# EAGLE design loochi-0.6 (EAGLE 6.2)
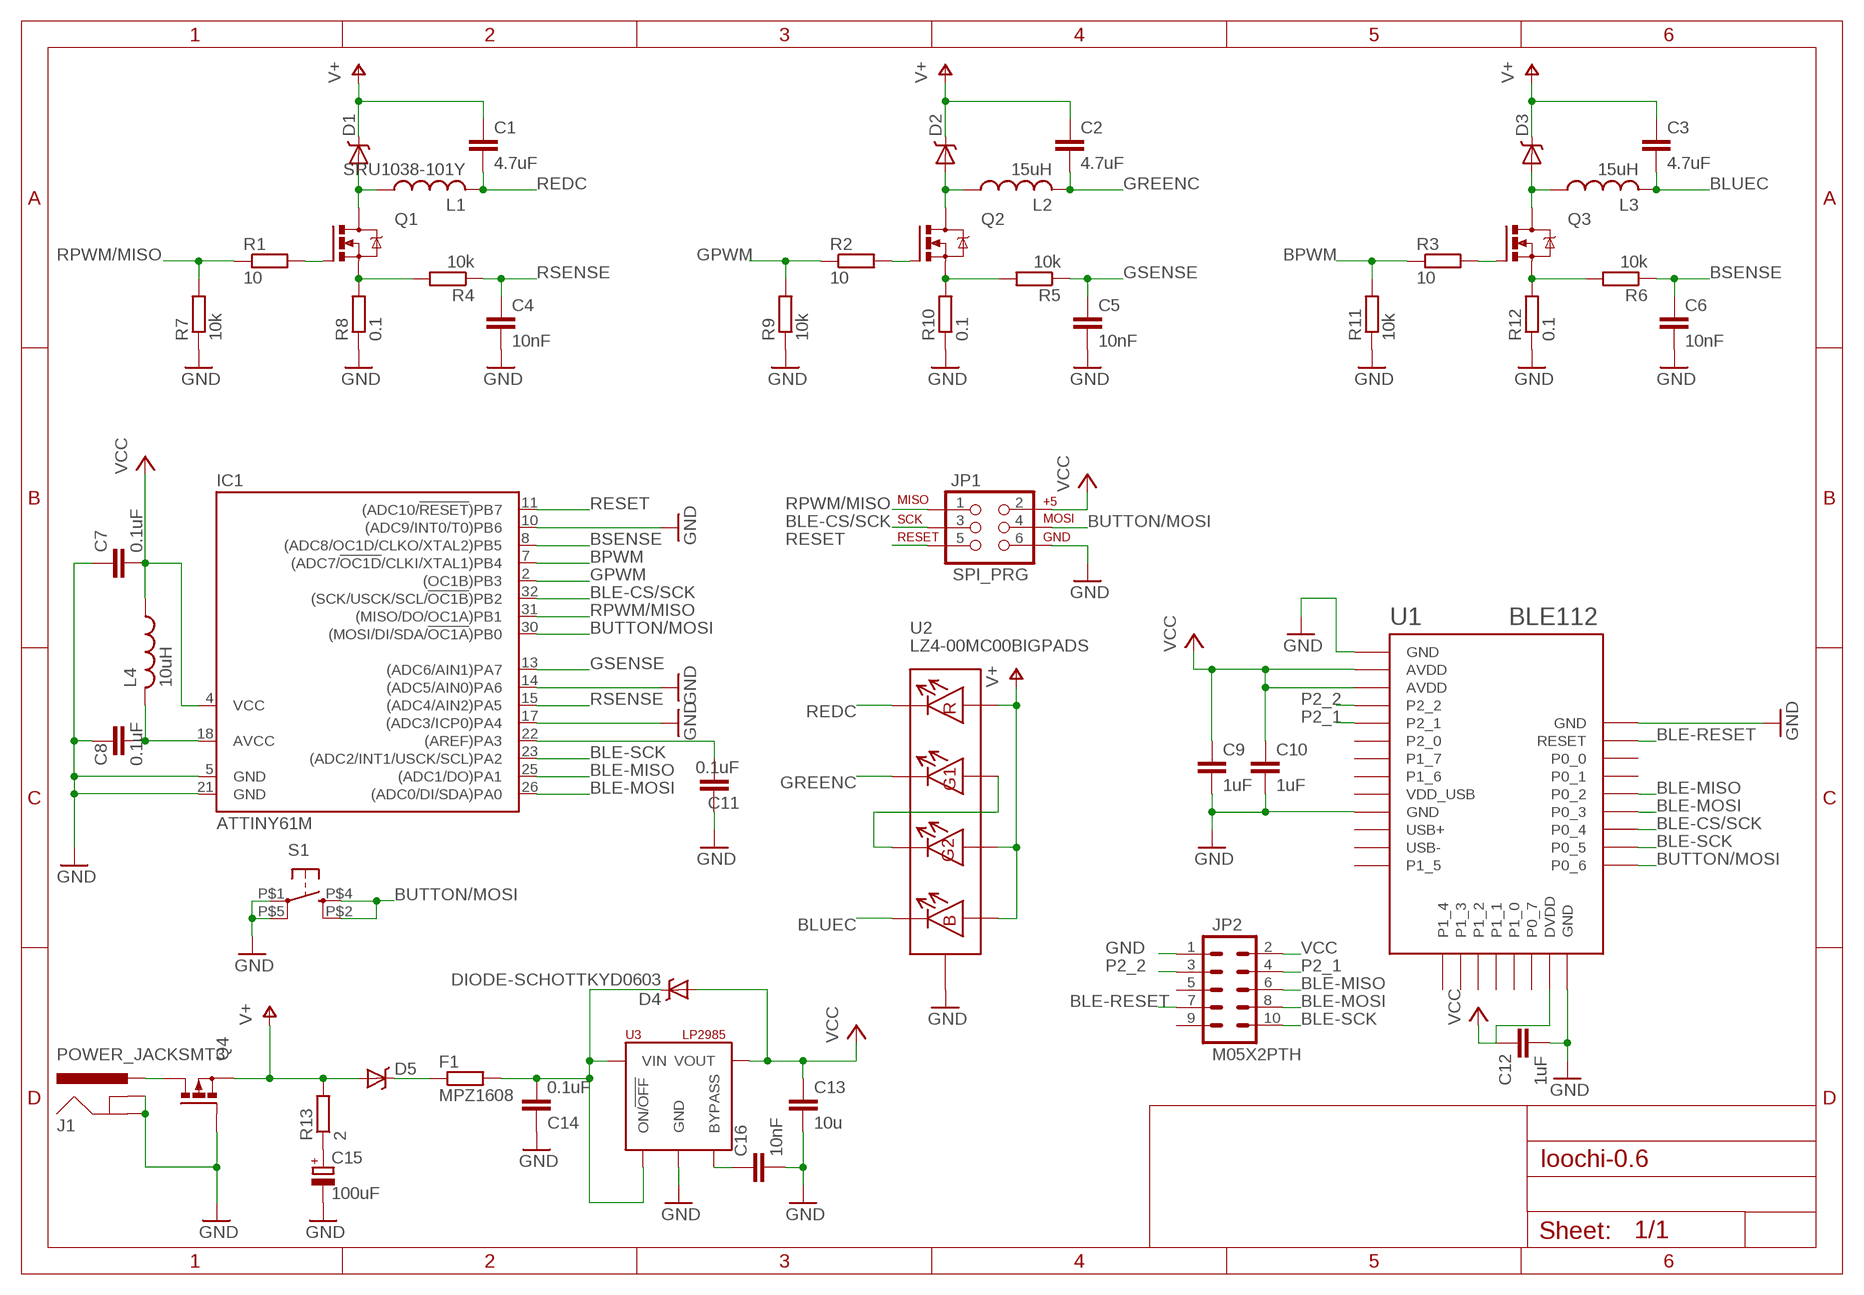
[diagram p0: schematic, sheet 1]

## Parts
C1  4.7uF  C-EUC0603  [C0603]
C2  4.7uF  C-EUC0603  [C0603]
C3  4.7uF  C-EUC0603  [C0603]
C4  10nF  C-EUC0603  [C0603]
C5  10nF  C-EUC0603  [C0603]
C6  10nF  C-EUC0603  [C0603]
C7  0.1uF  C-EUC0603  [C0603]
C8  0.1uF  C-EUC0603  [C0603]
C9  1uF  C-EUC0603  [C0603]
C10  1uF  C-EUC0603  [C0603]
C11  0.1uF  C-EUC0603  [C0603]
C12  1uF  C-EUC0603  [C0603]
C13  10u  C-EUC0603  [C0603]
C14  0.1uF  C-EUC0603K  [C0603K]
C15  100uF  CPOL-EUD  [PANASONIC_D]
C16  10nF  C-EUC0603  [C0603]
D1  PMEG4010CEH  DIODE-SCHOTTKY  [SOD123F]
D2  PMEG4010CEH  DIODE-SCHOTTKY  [SOD123F]
D3  PMEG4010CEH  DIODE-SCHOTTKY  [SOD123F]
D4  DIODE-SCHOTTKYD0603  [D0603]
D5  PMEG4010CEH  DIODE-SCHOTTKY  [SOD123F]
F1  MPZ1608  R-EU_R0603  [R0603]
IC1  ATTINY61M  [MLF32]
J1  POWER_JACKSMT3  [POWER-KYCONSMT3]
JP1  SPI_PRG  AVR_SPI_PRG_6NS  [2X3-NS]
JP2  M05X2PTH  [AVR_ICSP]
L1  SRU1038-101Y  L-USBOURNS-SRU1038  [BOURNS-SRU1038]
L2  15uH  L-USBOURNS-SRU1038  [BOURNS-SRU1038]
L3  15uH  L-USBOURNS-SRU1038  [BOURNS-SRU1038]
L4  10uH  L-USL0603  [L0603]
Q1  PMN25ENSOT457  [SOT457]
Q2  PMN25ENSOT457  [SOT457]
Q3  PMN25ENSOT457  [SOT457]
Q4  FDC654P  [SUPERSOT6]
R1  10  R-EU_R0603  [R0603]
R2  10  R-EU_R0603  [R0603]
R3  10  R-EU_R0603  [R0603]
R4  10k  R-EU_R0603  [R0603]
R5  10k  R-EU_R0603  [R0603]
R6  10k  R-EU_R0603  [R0603]
R7  10k  R-EU_R0603  [R0603]
R8  0.1  R-EU_R0603  [R0603]
R9  10k  R-EU_R0603  [R0603]
R10  0.1  R-EU_R0603  [R0603]
R11  10k  R-EU_R0603  [R0603]
R12  0.1  R-EU_R0603  [R0603]
R13  2  R-EU_R0603  [R0603]
S1  TAC_SWITCH  [CK-KMS_PEGS]
U1  BLE112  SF-BLUEGIGA_BLE112-A-VISUAL  [SF-BLUEGIGA_BLE112-A]
U2  LZ4-00MC00BIGPADS  [LZ4-00MC00-BIGPADS]
U3  LP2985  [DBV]

## Nets
BLE-CS/SCK: IC1.32((SCK/USCK/SCL/!OC1B!)PB2) JP1.3 U1.P0_4
BLE-MISO: IC1.25((ADC1/DO)PA1) JP2.6 U1.P0_2
BLE-MOSI: IC1.26((ADC0/DI/SDA)PA0) JP2.8 U1.P0_3
BLE-RESET: JP2.7 U1.RESET
BLE-SCK: IC1.23((ADC2/INT1/USCK/SCL)PA2) JP2.10 U1.P0_5
BLUEC: C3.2 L3.P$2 U2.P$8
BPWM: IC1.7((ADC7/!OC1D!/CLKI/XTAL1)PB4) R3.1 R11.2
BSENSE: C6.1 IC1.8((ADC8/OC1D/CLKO/XTAL2)PB5) R6.1
BUTTON/MOSI: IC1.30((MOSI/DI/SDA/!OC1A!)PB0) JP1.4 S1.P$2 S1.P$4 U1.P0_6
GND: C4.2 C5.2 C6.2 C7.1 C8.1 C9.2 C10.2 C11.1 C12.2 C13.2 C14.1 C15.- C16.2 IC1.5(GND) IC1.10((ADC9/INT0/T0)PB6) IC1.14((ADC5/AIN0)PA6) IC1.17((ADC3/ICP0)PA4) IC1.21(GND) J1.P$2(GND) J1.P$3(GNDBREAK) JP1.6 JP2.1 Q4.P$3(G) R7.1 R8.1 R9.1 R10.1 R11.1 R12.1 S1.P$1 S1.P$5 U1.GND1(GND) U1.GND2(GND) U1.GND3(GND) U1.GND4(GND) U2.P$9(THERMAL) U2.THERMAL U2.THERMAL1(THERMAL) U2.THERMAL2(THERMAL) U2.THERMAL3(THERMAL) U2.THERMAL4(THERMAL) U2.THERMAL5(THERMAL) U2.THERMAL6(THERMAL) U2.THERMAL7(THERMAL) U2.THERMAL8(THERMAL) U2.THERMAL9(THERMAL) U3.2(GND)
GPWM: IC1.2((OC1B)PB3) R2.1 R9.2
GREENC: C2.2 L2.P$2 U2.P$6
GSENSE: C5.1 IC1.13((ADC6/AIN1)PA7) R5.1
N$1: U2.P$2 U2.P$5
N$3: Q3.P$3(G) R3.2
N$4: Q2.P$3(G) R2.2
N$5: Q1.P$3(G) R1.2
N$6: D5.P$C(C) F1.1
N$7: Q1.P$4(S) R4.2 R8.2
N$8: D1.P$A(A) L1.P$1 Q1.P$1(D) Q1.P$2(D) Q1.P$5(D) Q1.P$6(D)
N$9: C11.2 IC1.22((AREF)PA3)
N$10: J1.P$1(PWR) Q4.P$1(D) Q4.P$2(D) Q4.P$5(D) Q4.P$6(D)
N$11: C8.2 IC1.18(AVCC) L4.2
N$13: C16.1 U3.4(BYPASS)
N$14: D2.P$A(A) L2.P$1 Q2.P$1(D) Q2.P$2(D) Q2.P$5(D) Q2.P$6(D)
N$17: Q2.P$4(S) R5.2 R10.2
N$21: C15.+ R13.1
N$22: C14.2 D4.CATHODE(C) F1.2 U3.1(VIN) U3.3(ON/!OFF!)
N$23: D3.P$A(A) L3.P$1 Q3.P$1(D) Q3.P$2(D) Q3.P$5(D) Q3.P$6(D)
N$25: Q3.P$4(S) R6.2 R12.2
P2_1: JP2.4 U1.P2_1
P2_2: JP2.3 U1.P2_2
REDC: C1.2 L1.P$2 U2.P$4
RESET: IC1.11((ADC10/!RESET!)PB7) JP1.5
RPWM/MISO: IC1.31((MISO/DO/OC1A)PB1) JP1.1 R1.1 R7.2
RSENSE: C4.1 IC1.15((ADC4/AIN2)PA5) R4.1
V+: C1.1 C2.1 C3.1 D1.P$C(C) D2.P$C(C) D3.P$C(C) D5.P$A(A) Q4.P$4(S) R13.2 U2.P$1 U2.P$3 U2.P$7
VCC: C7.2 C9.1 C10.1 C12.1 C13.1 D4.ANODE(A) IC1.4(VCC) JP1.2 JP2.2 L4.1 U1.AVDD1(AVDD) U1.AVDD2(AVDD) U1.DVDD U3.5(VOUT)
Unconnected: JP2.5 JP2.9 U1.P0_0 U1.P0_1 U1.P0_7 U1.P1_0 U1.P1_1 U1.P1_2 U1.P1_3 U1.P1_4 U1.P1_5 U1.P1_6 U1.P1_7 U1.P2_0 U1.USB+ U1.USB-

## Power pins joined to a net without a drawn wire
VDD_USB: U1.VDD_USB

## Library data of the parts
C1-C14 C16 = rcl:C-EU: CAPACITOR, European symbol
C15 = rcl:CPOL-EU: POLARIZED CAPACITOR, European symbol
D1-D5 = diode-schottky:DIODE-SCHOTTKY
F1 R1-R13 = rcl:R-EU_: RESISTOR, European symbol
IC1 = attinyx61:ATTINY*61: AtTinyX61; OC_FARNELL: unknown; OC_NEWARK: unknown
J1 = power-connectors:POWER_JACK: Power Jack This is the standard 5.5mm barrel jack for power. The PTH is the most common, proven, reliable, footprint. All others are experimental. The Slot footprint only works if the mill layer is transmitted to the PCB fab house so be warned. Spark Fun Electronics SKU : PRT-00119. Mating wall wart : TOL-00298 (and others)
JP1 = SparkFun:AVR_SPI_PRG_6: AVR ISP 6 Pin This is the reduced ISP connector for AVR programming. Common on Arduino. This footprint will take up less PCB space and can be used with a 10-pin to 6-pin adapter such as SKU: BOB-08508
JP2 = SparkFun:M05X2: Header 5x2 Standard 10-pin dual row 0.1" header. Commonly used with AVR-ISP. Use with Spark Fun Electronics SKU: PRT-00778
L1-L4 = inductors:L-US: INDUCTOR, American symbol
Q1-Q3 = mosfet:PMN25EN: N-CHANNEL MOS FET
Q4 = mosfet:FDC654P: FDC654P
S1 = buttons:TAC_SWITCH: Momentary Switch Button commonly used for reset or general input. Spark Fun Electronics SKU : COM-00097
U1 = ble112:SF-BLUEGIGA_BLE112-A-VISUAL: Bluetooth Low Energy single-mode module - Bluetooth 4.0, chip antenna
U2 = ledengin:LZ4-00MC00
U3 = ti-regulators:LP2985

## Board
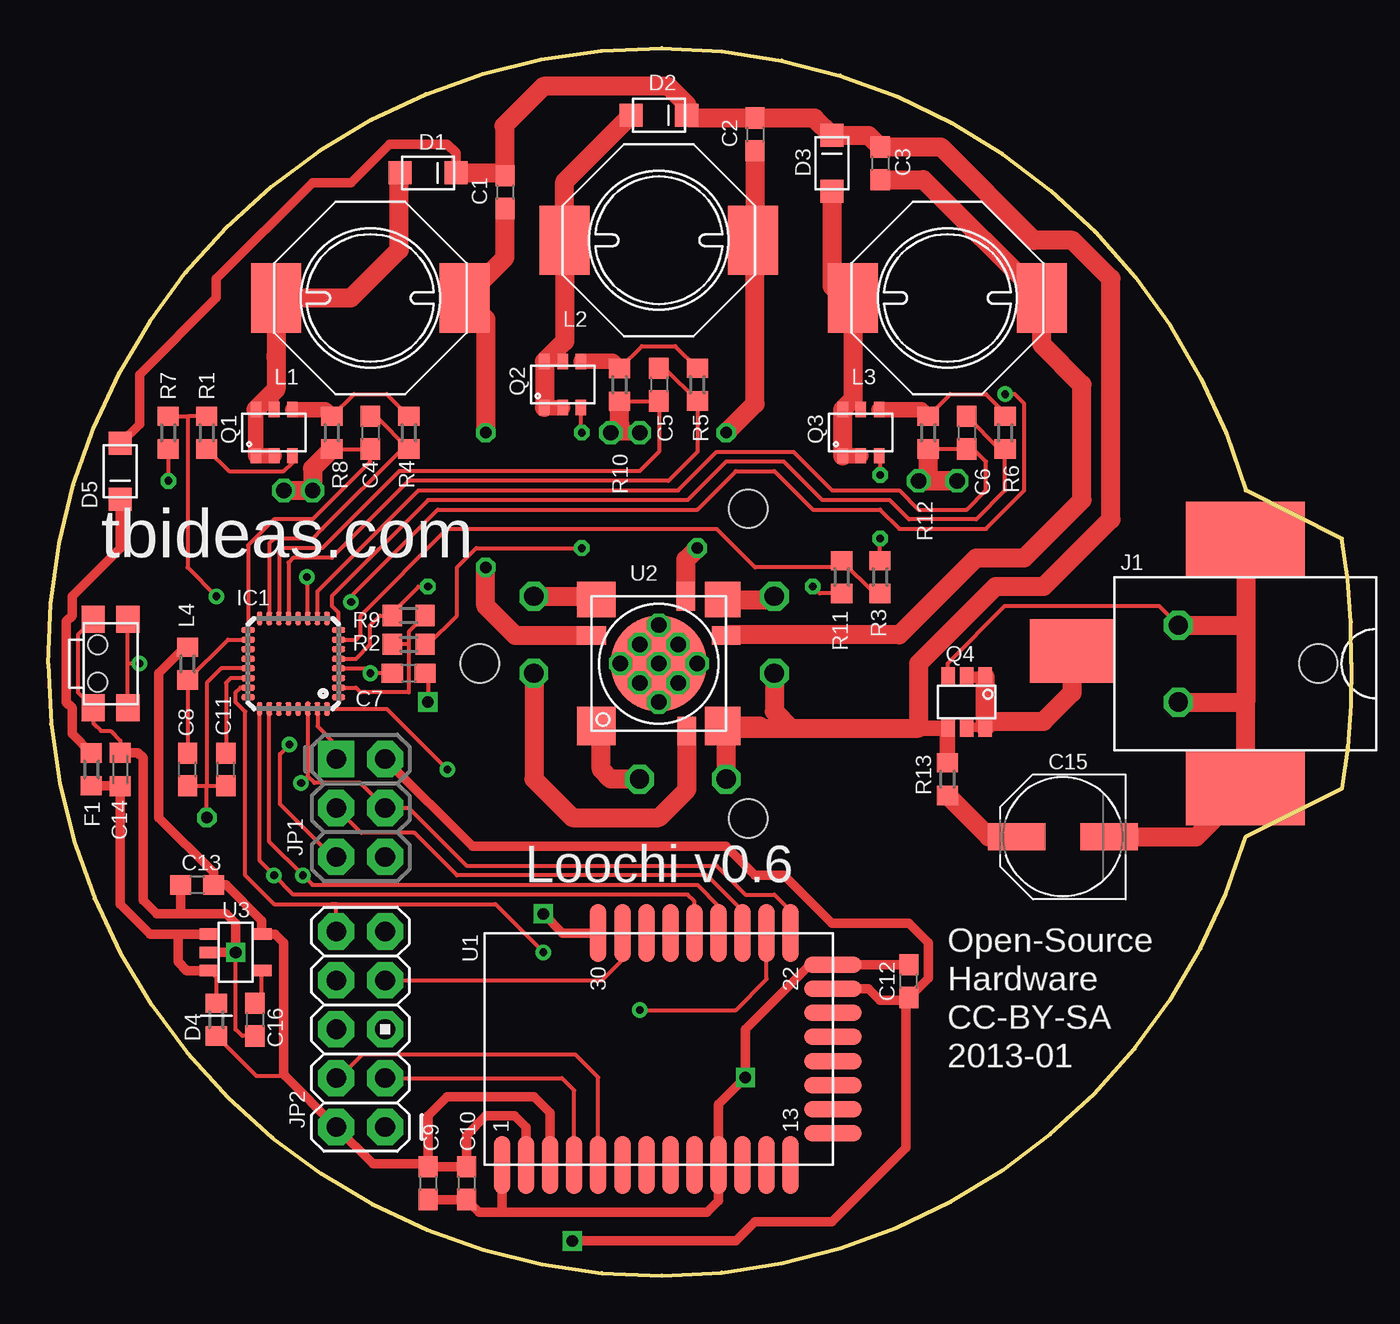
[diagram p1: board, top side]
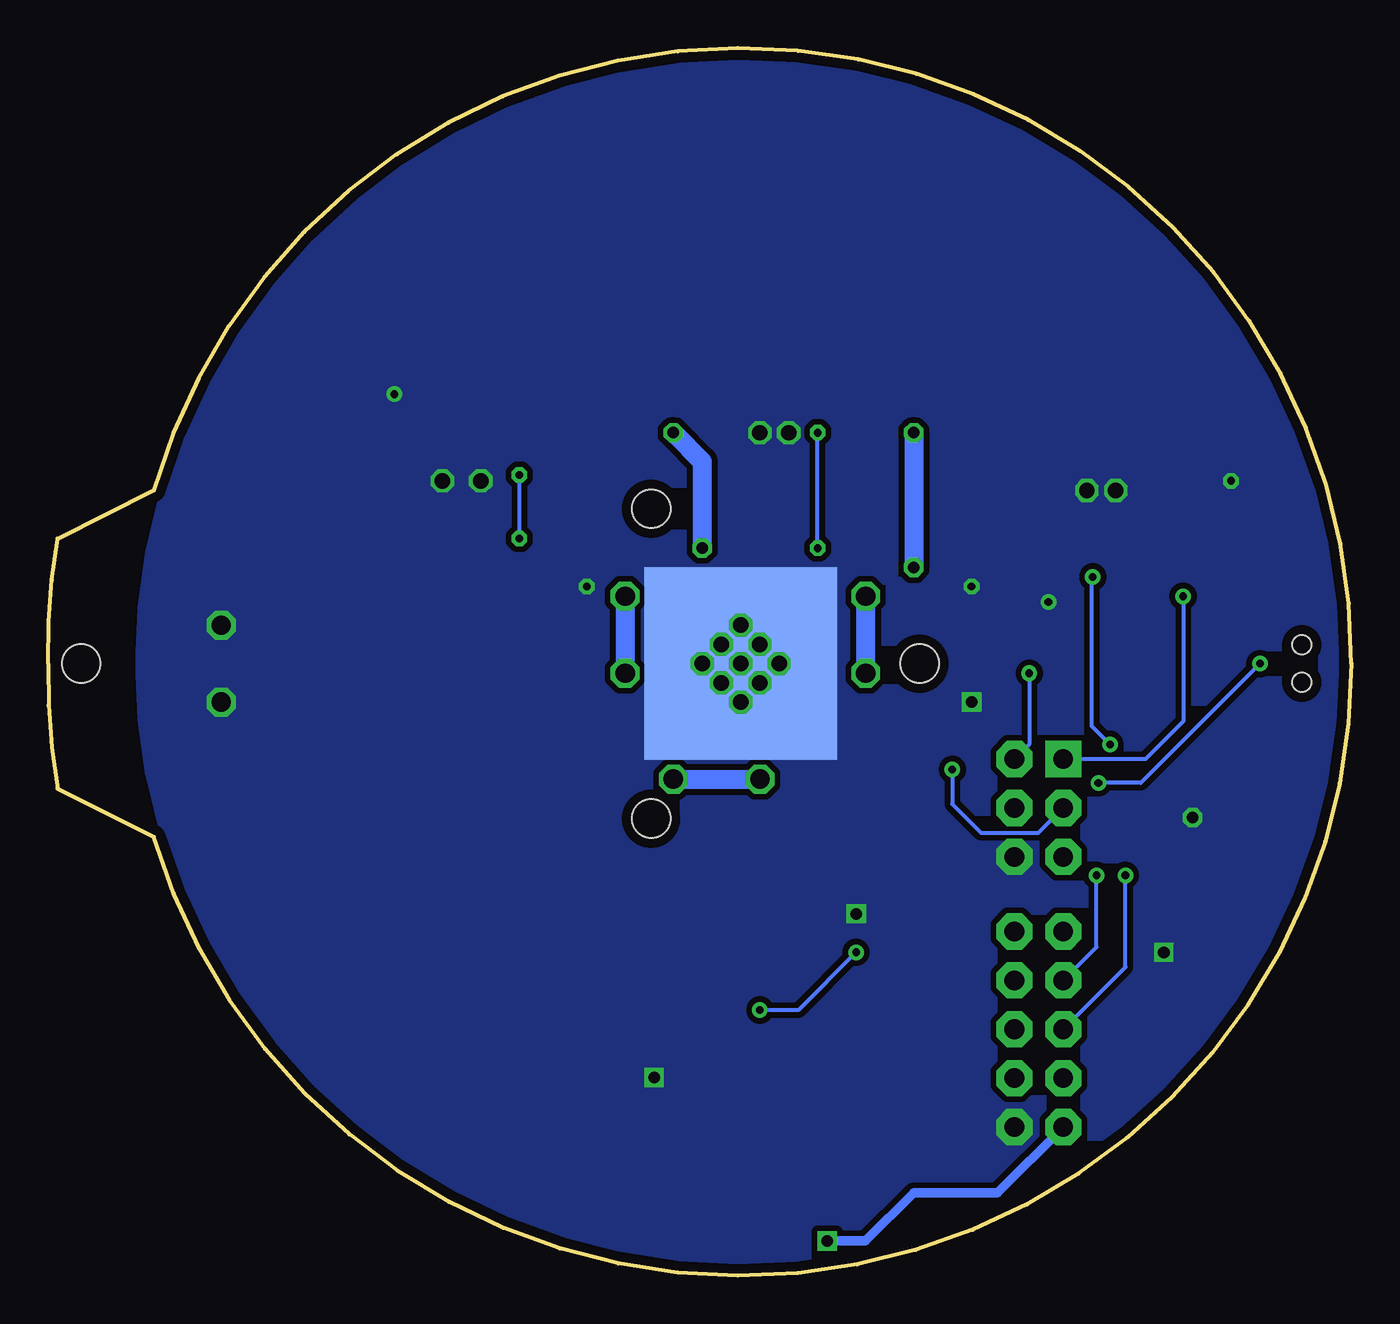
[diagram p2: board, bottom side, seen from below]

Size 67.75 x 63.79 mm. Coordinates in mm from the lower left corner, seen from the top.
Outline: 67.75,31.81 arc-11 67.25,25.31 62.25,22.81 arc-164 0,31.81 arc-164 62.25,40.81 67.25,38.31 arc-11 67.75,31.81
Copper layers (1*16): Top 0.0178mm / dielectric 59mil / Bottom 0.0178mm
Design rules: minimum track width 6mil, minimum drill 14mil, track to track 6mil, track to pad 6mil, pad to pad 6mil, via to via 6mil, smd to smd 6mil, copper to edge 20mil, drill to drill 16mil, minimum pad ring 8mil, minimum via ring 8mil, stop-mask expansion 3mil, vias tented up to drill 0mil, thermal gap 10mil
Holes 2 mm at 22.45,31.81 36.4,39.86 36.4,23.76

### Footprints (pad centres in the part's own frame; a part is rotated, then mirrored left to right if it is on the bottom)
C0603 = smd 1.1 x 1: 1 -0.85,0; 2 0.85,0
C0603K = smd 1.05 x 1.08: 1 -0.875,0; 2 0.875,0
PANASONIC_D = smd 3 x 1.4: + 2.4,0; - -2.4,0
SOD123F = smd 1.2 x 1.2: P$A -1.45,0; P$C 1.45,0
D0603 = smd 1 x 1.1: ANODE -0.85,0; CATHODE 0.85,0
R0603 = smd 1 x 1.1: 1 -0.85,0; 2 0.85,0
MLF32 = smd 0.7 x 0.3: 1 -2.35,1.75; 2 -2.35,1.25; 3 -2.35,0.75; 4 -2.35,0.25; 5 -2.35,-0.25; 6 -2.35,-0.75; 7 -2.35,-1.25; 8 -2.35,-1.75; 17 2.35,-1.75; 18 2.35,-1.25; 19 2.35,-0.75; 20 2.35,-0.25; 21 2.35,0.25; 22 2.35,0.75; 23 2.35,1.25; 24 2.35,1.75 | smd 0.3 x 0.7: 9 -1.75,-2.35; 10 -1.25,-2.35; 11 -0.75,-2.35; 12 -0.25,-2.35; 13 0.25,-2.35; 14 0.75,-2.35; 15 1.25,-2.35; 16 1.75,-2.35; 25 1.75,2.35; 26 1.25,2.35; 27 0.75,2.35; 28 0.25,2.35; 29 -0.25,2.35; 30 -0.75,2.35; 31 -1.25,2.35; 32 -1.75,2.35
POWER-KYCONSMT3 = smd 4.4 x 3.3: P$1 9,-0.65 | smd 6.2 x 3.9: P$2 0,6.45; P$3 0,-6.45 | hole 2: -3.8,0
2X3-NS = drill 1.016 pad 1.88 square: 1 -2.54,-1.27 | drill 1.016 pad 1.88 octagon: 2 -2.54,1.27; 3 0,-1.27; 4 0,1.27; 5 2.54,-1.27; 6 2.54,1.27
AVR_ICSP = drill 1.016 pad 1.88 octagon: 1 -1.27,5.08; 2 1.27,5.08; 3 -1.27,2.54; 4 1.27,2.54; 5 -1.27,0; 6 1.27,0; 7 -1.27,-2.54; 8 1.27,-2.54; 9 -1.27,-5.08; 10 1.27,-5.08
BOURNS-SRU1038 = smd 2.6 x 3.6: P$1 -4.9,0; P$2 4.9,0
L0603 = smd 1 x 1.1: 1 -0.85,0; 2 0.85,0
SOT457 = smd 0.8 x 0.55: P$1 -1.2,0.95; P$2 -1.2,0; P$3 -1.2,-0.95; P$4 1.2,-0.95; P$5 1.2,0; P$6 1.2,0.95
SUPERSOT6 = smd 0.7 x 1: P$1 -0.95,-1.3; P$2 0,-1.3; P$3 0.95,-1.3; P$4 0.95,1.3; P$5 0,1.3; P$6 -0.95,1.3
CK-KMS_PEGS = smd 1.2 x 1.4: P$1 -0.9,2.3; P$2 0.9,2.3; P$4 0.9,-2.3; P$5 -0.9,-2.3 | hole 1: -0.675,0.975; -0.675,-0.975
SF-BLUEGIGA_BLE112-A = smd 3 x 0.85: AVDD1 -6.05,6.9; AVDD2 -6.05,5.65; GND1 -6.05,8.15; GND2 -6.05,-3.1; GND4 6,3.15; P0_0 6,0.65; P0_1 6,-0.6; P0_2 6,-1.85; P0_3 6,-3.1; P0_4 6,-4.35; P0_5 6,-5.6; P0_6 6,-6.85; P1_5 -6.05,-6.85; P1_6 -6.05,-0.6; P1_7 -6.05,0.65; P2_0 -6.05,1.9; P2_1 -6.05,3.15; P2_2 -6.05,4.4; RESET 6,1.9; USB+ -6.05,-4.35; USB- -6.05,-5.6; VDD_USB -6.05,-1.85 | smd 0.85 x 3: DVDD 3.1,-9.05; GND3 4.35,-9.05; P0_7 1.85,-9.05; P1_0 0.6,-9.05; P1_1 -0.65,-9.05; P1_2 -1.9,-9.05; P1_3 -3.15,-9.05; P1_4 -4.4,-9.05
LZ4-00MC00-BIGPADS = smd 1.84 x 2: P$1 -3.33,3.25 | smd 0.96 x 1.5: P$2 -1.45,3.5; P$6 -1.4,-3.5 | smd 2 x 2: P$3 3.25,3.25 | smd 1.5 x 0.96: P$4 3.5,-1.45; P$8 -3.5,-1.45 | smd 2 x 1.84: P$5 3.25,-3.33 | smd 1.84 x 1.84: P$7 -3.33,-3.33 | smd 10 x 10 bottom: P$9 0,0 | smd 5 x 5: THERMAL 0,0 | drill 0.8 octagon: THERMAL1 0,0; THERMAL2 0,2; THERMAL3 1,1; THERMAL4 2,0; THERMAL5 1,-1; THERMAL6 0,-2; THERMAL7 -1,-1; THERMAL8 -2,0; THERMAL9 -1,1
DBV = smd 0.6 x 1.05: 1 -0.95,-1.35; 2 0,-1.35; 3 0.95,-1.35; 4 0.95,1.35; 5 -0.95,1.35

### Placement (x,y rotation side)
C1  23.75,56.31 270 top
C2  36.75,59.31 270 top
C3  43.25,57.81 270 top
C4  16.75,43.81 270 top
C5  31.75,46.31 270 top
C6  47.75,43.81 270 top
C7  18.75,31.31 180 top
C8  7.25,26.31 90 top
C9  19.75,4.81 270 top
C10  21.75,4.81 270 top
C11  9.25,26.31 90 top
C12  44.75,15.31 90 top
C13  7.75,20.31 180 top
C14  3.75,26.31 270 top
C15  52.75,22.81 180 top
C16  10.75,13.31 270 top
D1  19.75,57.31 0 top
D2  31.75,60.31 0 top
D3  40.75,57.81 90 top
D4  8.75,13.31 90 top
D5  3.75,41.81 270 top
F1  2.25,26.31 270 top
IC1  12.75,31.81 180 top
J1  62.23,31.81 180 top
JP1  16.25,24.31 270 top
JP2  16.25,12.81 180 top
L1  16.75,50.81 0 top
L2  31.75,53.81 0 top
L3  46.75,50.81 0 top
L4  7.25,31.81 270 top
Q1  11.75,43.81 90 top
Q2  26.75,46.31 90 top
Q3  42.25,43.81 90 top
Q4  47.75,29.81 180 top
R1  8.25,43.81 270 top
R2  18.75,32.81 0 top
R3  43.25,36.31 90 top
R4  18.75,43.81 90 top
R5  33.75,46.31 90 top
R6  49.75,43.81 90 top
R7  6.25,43.81 90 top
R8  14.75,43.81 90 top
R9  18.75,34.31 0 top
R10  29.71,46.3 90 top
R11  41.25,36.31 90 top
R12  45.75,43.81 90 top
R13  46.75,25.81 90 top
S1  3.25,31.81 0 top
U1  31.75,11.81 90 top
U2  31.75,31.81 180 top
U3  9.75,16.81 270 top

### Tracks (layer width: path | path; a pad name or v marks a point on that pad's centre or on a via)
BLE-CS/SCK  (via drill 0.4)
  Top 0.2: U1.P0_4 36.1,18.96 34.25,20.81 21.25,20.81 19.05,23.01 16.28,23.01 JP1.3 | IC1.32 17.6,29.46 v20.75,26.31
  Bottom 0.2: v20.75,26.31 20.75,24.51 19.25,23.01 16.28,23.01 JP1.3
BLE-MISO  (via drill 0.4)
  Top 0.2: U1.P0_2 33.6,19.46 33.25,19.81 12.75,19.81 v11.75,20.81 11,21.56 IC1.25
  Bottom 0.2: JP2.6 11.75,16.04 v11.75,20.81
BLE-MOSI  (via drill 0.4)
  Top 0.2: U1.P0_3 34.85,19.21 33.75,20.31 13.75,20.31 v13.25,20.81 11.5,22.56 IC1.26
  Bottom 0.2: JP2.8 13.25,17.08 v13.25,20.81
BLE-RESET
  Top 0.2: JP2.7 28.79,15.35 29.75,16.31 29.75,17.71 U1.RESET
BLE-SCK  (via drill 0.4)
  Top 0.2: 14.98,19.31 23.25,19.31 v25.75,16.81 | v30.75,13.81 35.75,13.81 37.35,15.41 U1.P0_5 | IC1.23 10,30.56 9.75,30.31 9.75,29.81 10.25,29.31 10.25,20.81 11.75,19.31 14.75,19.31 14.98,19.31 | JP2.10 14.98,19.31
  Bottom 0.2: v25.75,16.81 28.75,13.81 v30.75,13.81
BLUEC
  Top 1: U2.P$8 35.3,33.31 44.25,33.31 48.25,37.31 50.75,37.31 53.75,40.31 53.75,46.31 51.65,48.41 L3.P$2 45.5,56.96 C3.2
BPWM
  Top 0.2: IC1.7 16,33.06 16.25,33.31 16.25,34.31 20.75,38.81 34.75,38.81 36.75,36.81 40.9,36.81 R11.2 42.95,35.46 R3.1
BSENSE
  Top 0.2: C6.1 49.45,42.96 R6.1 49.75,40.81 48.25,39.31 44.75,39.31 43.75,40.31 40.25,40.31 38.25,42.31 35.25,42.31 33.25,40.31 19.75,40.31 14.75,35.31 14.75,34.81 15.1,34.46 IC1.8 15.05,33.61 14.95,33.61
BUTTON/MOSI  (via drill 0.4)
  Top 0.2: IC1.30 13.5,29.56 | 13.5,29.76 IC1.30 | S1.P$4 4.15,31.81 | 4.15,31.81 S1.P$2 | v4.75,31.81 4.15,31.81 | IC1.30 13.5,25.96 | 13.5,25.96 v13.15,25.61 | 13.5,25.96 13.85,25.61 16.22,25.61 JP1.4 18.75,24.31 21.75,21.31 34.75,21.31 36.25,19.81 37.75,19.81 38.6,18.96 U1.P0_6
  Bottom 0.2: v4.75,31.81 10.95,25.61 v13.15,25.61
GND  (via drill 0.4, 0.6, 0.8, 1)
  Top 0.2: R10.1 C5.2 31.75,42.81 30.75,41.81 18.25,41.81 14.25,37.81 12.25,37.81 12,37.56 IC1.14 | R8.1 C4.2 16.75,42.31 13.75,39.31 11.75,39.31 10.4,37.96 IC1.17 | 8.25,25.46 C11.1 | 8.25,25.46 8.25,30.81 9,31.56 IC1.21 | C8.1 8.25,25.46 | IC1.10 14,35.56 19.25,40.81 32.75,40.81 34.75,42.81 38.75,42.81 40.75,40.81 44.25,40.81 45.25,39.81 47.75,39.81 48.75,40.81 48.75,42.31 48.1,42.96 C6.2 R12.1 | R7.1 v6.25,41.31 | R11.1 40.1,35.46 v39.75,35.81 | C7.1 19.75,31.16 v19.75,29.81 | 19.4,35.81 v19.75,35.81 19.25,35.81 17.75,34.31 | IC1.5 16,32.06 16.75,32.81 16.75,33.81 17.25,34.31 17.75,34.31 | v15.75,35.01 15.75,35.31 20.25,39.81 33.75,39.81 35.75,41.81 37.75,41.81 39.75,39.81 43.25,39.81 44.25,38.81 48.75,38.81 50.75,40.81 50.75,45.31 50.25,45.81 v49.75,45.81 | 17.75,34.31 R9.1 | v8.25,23.81 8.25,25.46 | C16.2 10.1,12.46 9.75,12.81 v9.75,16.81 | Q4.P$3 46.8,30.86 | v58.75,33.81 57.75,34.81 49.75,34.81 46.75,31.81 46.75,31.16 Q4.P$3 | S1.P$1 1.55,33.31 1.55,30.31 S1.P$5 2.35,28.71 2.75,28.31 3.25,28.31 3.75,27.81 C14.1 | Q4.P$3 46.8,31.36
  Top 0.5: C12.2 U1.GND3 39.6,16.16 36.25,12.81 v36.25,10.31 34.85,8.91 U1.GND2 34.85,3.91 34.25,3.31 23.75,3.31 | 28.75,17.81 U1.GND4 26.75,17.81 v25.75,18.81 | U3.2 v9.75,16.81 9.75,18.31 9.25,18.81 6.75,18.81 | 6.75,18.81 5.65,18.81 4.94,19.52 4.94,26.91 4.67,27.18 C14.1 | C13.2 6.9,18.96 6.75,18.81 | 23.75,3.31 22.4,3.31 C10.2 C9.2 | U1.GND1 23.6,3.46 23.75,3.31
  Top 0.8: v30.75,43.81 v29.25,43.81
  Top 1: v12.25,40.81 v13.75,40.81 13.75,41.96 R8.1 | v29.25,43.81 29.71,44.27 R10.1 | R12.1 45.75,41.31 v47.25,41.31 v45.25,41.31 | C15.- 59.68,22.81 J1.P$2 | 62.25,25.38 J1.P$2 | v58.75,29.81 62.25,29.81 | J1.P$3 62.25,38.24 62.25,33.81 | v58.75,33.81 62.25,33.81 | 62.25,33.81 62.25,29.81 | 62.25,29.81 62.23,29.79 J1.P$2
  Bottom 0.2: U2.THERMAL7 U2.THERMAL8 | U2.THERMAL9 U2.P$9 U2.THERMAL5 U2.THERMAL4 U2.THERMAL3 U2.THERMAL2
  pour Bottom (isolate 0.3, no thermals): 0.75,31.81 arc-90 31.75,62.81 arc-90 62.75,31.81 arc-90 31.75,0.81 arc-90
GPWM
  Top 0.2: IC1.2 16,30.56 16.25,30.31 18.75,30.31 18.75,32.81 | 18.1,32.81 R2.1 18.75,32.81 | R9.2 18.75,33.46 18.75,32.81
GREENC  (via drill 0.6)
  Top 1: C2.2 36.75,53.91 L2.P$2 36.75,53.71 36.75,45.31 v35.25,43.81 | U2.P$6 33.15,37.21 v33.75,37.81
  Bottom 1: v35.25,43.81 33.75,42.31 v33.75,37.81
GSENSE
  Top 0.2: C5.1 32.05,47.16 R5.1 33.75,42.81 32.25,41.31 18.75,41.31 14.75,37.31 12.75,37.31 12.5,37.06 IC1.13
N$1  (via drill 1)
  Top 1: v25.25,31.31 25.25,25.81 27.25,23.81 31.75,23.81 33.2,25.26 U2.P$2 | v25.25,35.31 28.33,35.31 U2.P$5
  Bottom 1: v25.25,35.31 v25.25,31.31
N$3  (via drill 0.4)
  Top 0.2: R3.2 v43.25,38.31 | Q3.P$3 43.25,42.56 v43.25,41.61
  Bottom 0.2: v43.25,38.31 v43.25,41.61
N$4  (via drill 0.4)
  Top 0.2: v27.75,37.81 22.25,37.81 21.25,36.81 21.25,34.31 19.75,32.81 R2.2 | v27.75,43.81 27.7,43.86 Q2.P$3
  Bottom 0.2: v27.75,37.81 v27.75,43.81
N$5
  Top 0.2: R1.2 9.4,41.81 12.25,41.81 12.7,42.26 Q1.P$3
N$6
  Top 0.5: D5.P$C 3.75,37.81 1.25,35.31 1.25,34.31 0.95,34.01 0.95,29.81 1.25,29.51 1.25,28.16 F1.1
N$7
  Top 0.2: R8.2 15.9,45.81 17.6,45.81 R4.2
  Top 0.8: R8.2 14.4,45.01 Q1.P$4
N$8
  Top 0.5: Q1.P$5 11.75,47.71
  Top 0.8: 11.75,47.71 11.85,47.81 | Q1.P$6 Q1.P$1 Q1.P$2 | 18.25,57.26 D1.P$A
  Top 1: Q1.P$6 11.85,46.06 11.85,47.81 L1.P$1 15.75,50.81 18.25,53.31 18.25,57.26
N$9
  Top 0.2: IC1.22 9.5,31.06 9.25,30.81 C11.2
N$10
  Top 0.5: Q4.P$5 Q4.P$6
  Top 0.6: Q4.P$2 Q4.P$1
  Top 1: 53.7,31.99 J1.P$1 53.23,30.29 51.75,28.81 49,28.81 Q4.P$6 Q4.P$1
N$11
  Top 0.2: IC1.18 9.35,33.06 L4.2 C8.2
N$13
  Top 0.2: 11.1,13.81 C16.1 11.1,14.51 U3.4
N$14
  Top 0.5: Q2.P$5 Q2.P$6
  Top 0.8: Q2.P$2 Q2.P$1
  Top 1: D2.P$A 26.85,56.86 L2.P$1 26.85,48.56 Q2.P$6 Q2.P$1
N$17
  Top 0.2: R10.2 30.87,48.31 32.6,48.31 R5.2
  Top 0.8: R10.2 29.35,47.51 Q2.P$4
N$21
  Top 1: 50.2,22.96 C15.+ 48.9,22.81 R13.1
N$22
  Top 0.2: 3.73,25.46 C14.2 | U3.3 8.75,15.51 D4.CATHODE
  Top 0.5: F1.2 3.73,25.46 | C14.2 3.75,19.31 5.3,17.76 6.75,17.76 | 6.75,17.76 U3.1 | U3.3 7.2,15.86 6.75,16.31 6.75,17.76
N$23
  Top 0.5: 41.85,45.56 41.85,45.41 Q3.P$5
  Top 0.8: Q3.P$1 Q3.P$2
  Top 1: L3.P$1 41.85,50.31 | 41.85,50.31 41.85,45.56 Q3.P$6 Q3.P$1 | D3.P$A 40.75,51.41 41.85,50.31
N$25
  Top 0.2: R12.2 46.9,45.81 48.75,45.81 49.75,44.81 R6.2
  Top 0.8: R12.2 45.4,45.01 Q3.P$4
P2_1
  Top 0.2: U1.P2_1 28.6,10.31 27.4,11.51 16.35,11.51 15.11,10.27 JP2.4
P2_2
  Top 0.2: JP2.3 26.71,10.27 27.35,9.63 U1.P2_2
REDC  (via drill 0.6)
  Top 1: C1.2 23.75,52.91 21.75,50.91 L1.P$2 22.75,49.71 v22.75,43.81 | U2.P$4 24.3,33.26 22.75,34.81 v22.75,36.81
  Bottom 1: v22.75,43.81 v22.75,36.81
RESET  (via drill 0.4)
  Top 0.2: IC1.11 13.5,36.26 v13.45,36.31 | JP1.5 14.79,21.77 12.05,24.51 12.05,27.11 v12.55,27.61
  Bottom 0.2: v12.55,27.61 13.5,28.56 13.5,36.31 v13.45,36.31
RPWM/MISO  (via drill 0.4)
  Top 0.2: R7.2 7.25,44.66 | R1.1 7.25,44.66 | IC1.31 14,28.56 14.98,27.58 JP1.1 | 7.25,44.66 7.25,36.81 v8.75,35.31
  Bottom 0.2: v8.75,35.31 8.75,28.81 10.71,26.85 JP1.1
RSENSE
  Top 0.2: C4.1 17.05,44.66 R4.1 18.4,42.96 14.25,38.81 13.75,38.31 11.75,38.31 11.5,38.06 11.5,36.06 IC1.15
V+  (via drill 1)
  Top 0.2: Q4.P$4 46.8,28.36 46.75,28.31
  Top 0.5: D1.P$C 21.2,58.36 20.75,58.81 17.75,58.81 15.75,56.81 13.75,56.81 8.75,51.81 8.75,50.81 4.75,46.81 4.75,44.26 D5.P$A
  Top 0.8: D2.P$C 33.2,60.86 | R13.2 46.75,28.31 46.75,28.46 45.25,28.46
  Top 1: U2.P$1 35.25,28.39 v35.25,25.81 | v30.75,25.81 29.25,25.81 28.75,26.31 28.75,28.31 U2.P$3 | 33.2,60.86 32.25,61.81 25.75,61.81 23.7,59.76 23.75,59.71 C1.1 23.6,57.31 D1.P$C | v37.75,31.31 37.75,29.31 38.6,28.46 | 37,28.56 U2.P$1 | 38.6,28.46 35.18,28.46 U2.P$1 | D2.P$C 33.35,60.16 C2.1 39.85,60.16 D3.P$C 42.65,59.26 C3.1 46.4,58.66 51.25,53.81 53.25,53.81 55.25,51.81 55.25,39.31 51.75,35.81 49.25,35.81 45.25,31.81 45.25,28.46 38.6,28.46 | U2.P$7 37.58,35.14 v37.75,35.31
  Bottom 1: v35.25,25.81 v30.75,25.81 | v37.75,35.31 v37.75,31.31
VCC  (via drill 0.4, 0.6)
  Top 0.2: IC1.4 16.5,31.56 v16.75,31.31 C7.2 | 8.6,20.61 C13.1 | D4.ANODE 10.82,10.38 12.32,10.38
  Top 0.5: C13.1 9.25,20.31 11.1,18.46 U3.5 11.8,17.76 12.25,17.31 12.25,10.46 12.32,10.38 JP2.2 16.9,5.81 19.6,5.81 C9.1 | JP1.2 22.06,22.31 35.25,22.31 36.75,20.81 38.25,20.81 40.75,18.31 44.75,18.31 45.75,17.31 45.75,15.46 C12.1 44.6,14.31 | U1.AVDD1 24.85,7.71 24.25,8.31 22.75,8.31 21.75,7.31 C10.1 C9.1 | U1.DVDD 42.65,14.91 43.25,14.31 44.6,14.31 | 44.6,14.31 44.6,6.66 40.75,2.81 36.75,2.81 35.75,1.81 v27.25,1.81 | U1.AVDD2 26.1,8.46 25.25,9.31 20.75,9.31 19.75,8.31 C9.1 | 8.6,20.61 8.6,20.96 5.75,23.81 5.75,31.31 7.1,32.66 L4.1
  Bottom 0.2: v16.75,31.31 16.75,27.62 JP1.2
  Bottom 0.5: v27.25,1.81 25.25,1.81 22.75,4.31 18.4,4.31 JP2.2

### Text on the board
tPlace: tbideas.com | Loochi v0.6 | Open-Source | Hardware | CC-BY-SA | 2013-01
tNames: U2 | U3